# Altium project STLinkV2_1.PrjPcb (part 2 of 3)
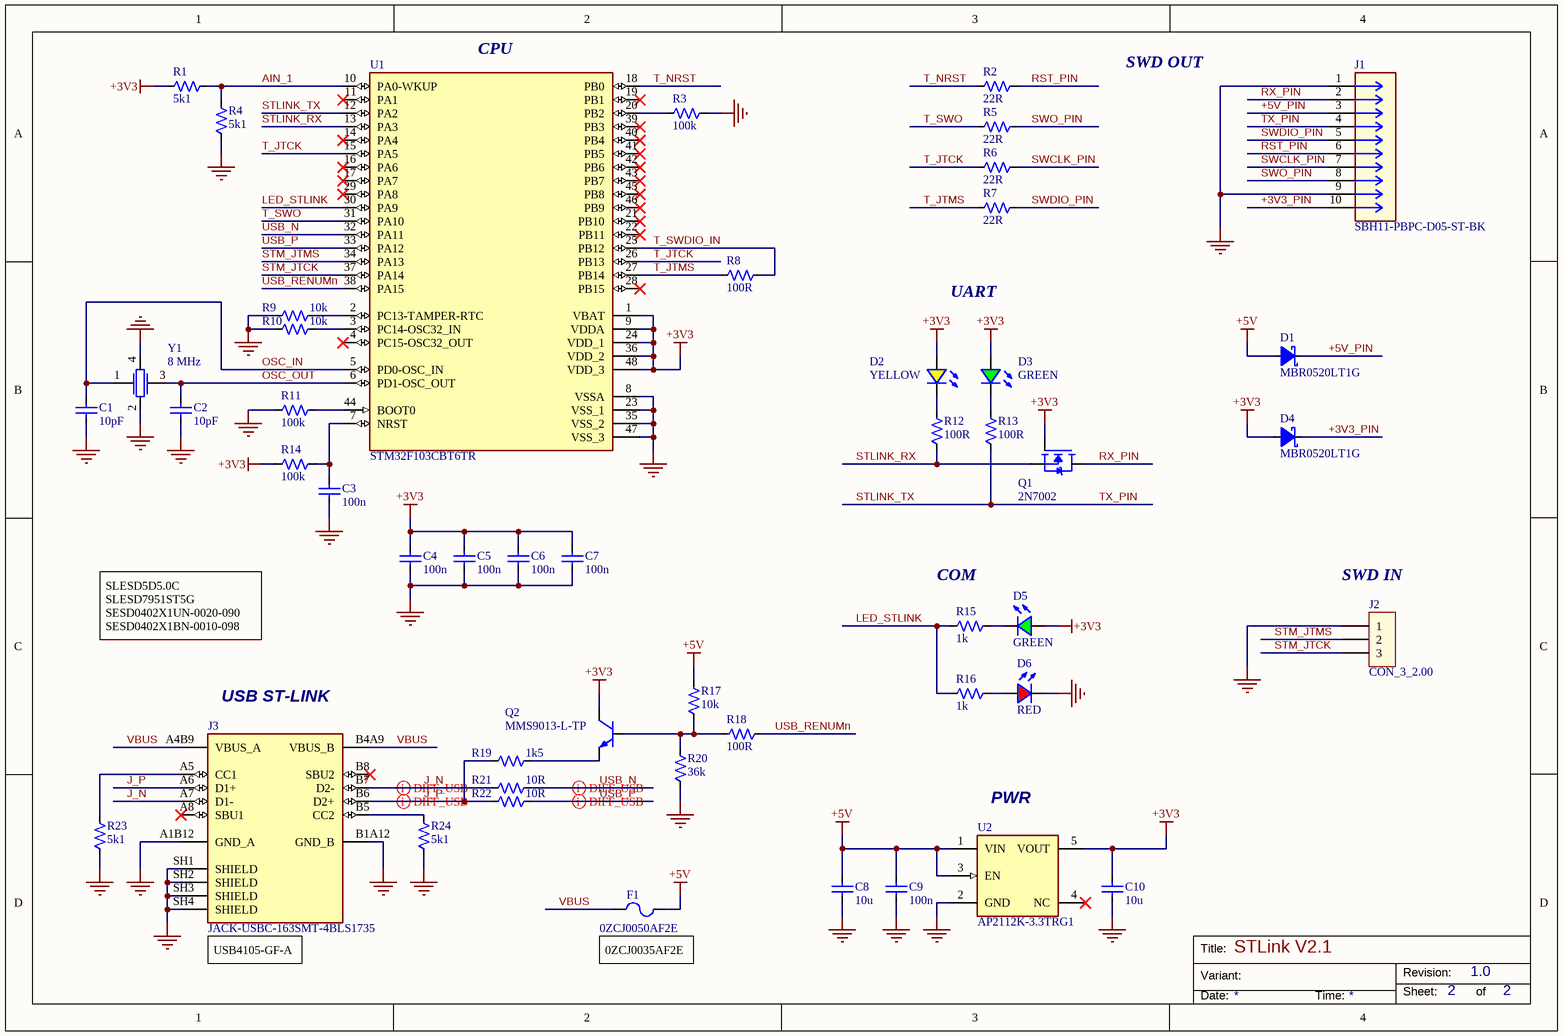
[diagram p2: [02]-STLinkV2_1.SchDoc]

## Sheet [02]-STLinkV2_1.SchDoc (continued)
### Library data of the parts
C1 C2 = CAP_GCM1555C1H100JA16D: 50V 10pF C0G ±5% 0402 Multilayer Ceramic Capacitors MLCC - SMD/SMT ROHS; Manufacturer 1: Murata; Manufacturer Lifecycle Status: IN PRODUCTION; Temperature Coefficient: 30ppm/°C; Supplier 1: DigiKey; Manufacturer Part Number 1: GCM1555C1H100JA16D; Stock 1: 360236; Pricing 1: 1=0,1, 10=0,027, 50=0,0178, 100=0,0152, 500=0,0107, 1000=0,00935, 2500=0,00792, 5000=0,00706 (USD); RoHS: Compliant; Capacitance: 10pF; Case/Package: 0402; Case Code (Imperial): 0402; Case Code (Metric): 1005; Dielectric: C0G; Dielectric Material: Ceramic; Export Control Classification Number (ECCN) Code: EAR99; Height: 500µm; Harmonized Tariff Schedule (HTS) Code: 8532.24.00.20; Introduction Date: 2013-11-20; Lead Free: Lead Free; Length: 1mm; Lifecycle Status: Production; Material: Ceramic; Max Operating Temperature: 125°C; Min Operating Temperature: -55°C; Mount: Surface Mount; Number of Terminals: 2; Ratings: AEC-Q200; REACH SVHC: Yes; Schedule B: 8532240020, 8532240020|8532240020, 8532240020|8532240020|8532240020, 8532240020|8532240020|8532240020|8532240020; Termination: SMD/SMT; Tolerance: 5%; Voltage Rating: 50V; Voltage Rating (DC): 50V; Weight: 6.010099mg; Width: 500µm; ComponentLink1URL: https://datasheet.octopart.com:443/GCM1555C1H100JA16D-Murata-datasheet-149522303.pdf?src-supplier=Farnell; ComponentLink1Description: https://datasheet.octopart.com:443/GCM1555C1H100JA16D-Murata-datasheet-149522303.pdf?src-supplier=Farnell; ComponentLink2URL: https://datasheet.octopart.com:443/GCM1555C1H100JA16D-Murata-datasheet-46741789.pdf?src-supplier=element14+APAC; ComponentLink2Description: https://datasheet.octopart.com:443/GCM1555C1H100JA16D-Murata-datasheet-46741789.pdf?src-supplier=element14+APAC; ComponentLink3URL: https://datasheet.octopart.com:443/GCM1555C1H100JA16D-Murata-datasheet-140655912.pdf?src-supplier=Ciiva; ComponentLink3Description: https://datasheet.octopart.com:443/GCM1555C1H100JA16D-Murata-datasheet-140655912.pdf?src-supplier=Ciiva; ComponentLink4URL: https://datasheet.octopart.com:443/GCM1555C1H100JA16D-Murata-datasheet-138715603.pdf?src-supplier=Ciiva; ComponentLink4Description: https://datasheet.octopart.com:443/GCM1555C1H100JA16D-Murata-datasheet-138715603.pdf?src-supplier=Ciiva; ComponentLink5URL: https://datasheet.octopart.com:443/GCM1555C1H100JA16D-Murata-datasheet-118179445.pdf?src-supplier=Future+Electronics; ComponentLink5Description: https://datasheet.octopart.com:443/GCM1555C1H100JA16D-Murata-datasheet-118179445.pdf?src-supplier=Future+Electronics; ComponentLink6URL: https://datasheet.octopart.com:443/GCM1555C1H100JA16D-Murata-datasheet-12532847.pdf?src-supplier=Future+Electronics; ComponentLink6Description: https://datasheet.octopart.com:443/GCM1555C1H100JA16D-Murata-datasheet-12532847.pdf?src-supplier=Future+Electronics; ComponentLink7URL: https://datasheet.octopart.com:443/GCM1555C1H100JA16D-Murata-datasheet-34148896.pdf?src-supplier=Future+Electronics; ComponentLink7Description: https://datasheet.octopart.com:443/GCM1555C1H100JA16D-Murata-datasheet-34148896.pdf?src-supplier=Future+Electronics; ComponentLink8URL: https://datasheet.octopart.com:443/GCM1555C1H100JA16D-Murata-datasheet-44780974.pdf?src-supplier=Future+Electronics; ComponentLink8Description: https://datasheet.octopart.com:443/GCM1555C1H100JA16D-Murata-datasheet-44780974.pdf?src-supplier=Future+Electronics; ComponentLink9URL: https://datasheet.octopart.com:443/GCM1555C1H100JA16D-Murata-datasheet-12511495.pdf?src-supplier=TME; ComponentLink9Description: https://datasheet.octopart.com:443/GCM1555C1H100JA16D-Murata-datasheet-12511495.pdf?src-supplier=TME; ComponentLink10URL: http://sigma.octopart.com:80/reach_statement/Murata-company-16.pdf?src-supplier=Compliance+Statements; ComponentLink10Description: http://sigma.octopart.com:80/reach_statement/Murata-company-16.pdf?src-supplier=Compliance+Statements; Supplier Part Number 1: 490-10668-1-ND
C3-C7 C9 = CAP_GCM155R71H104KE02D: 50V 100nF X7R ±10% 0402 Multilayer Ceramic Capacitors MLCC - SMD/SMT ROHS; Manufacturer 1: Murata; Manufacturer Lifecycle Status: IN PRODUCTION; Supplier 1: DigiKey; Manufacturer Part Number 1: GCM155R71H104KE02D; Stock 1: 10014269; Pricing 1: 1=0,1, 10=0,032, 50=0,0216, 100=0,0184, 500=0,01308, 1000=0,01147, 2500=0,00978, 5000=0,00876 (USD); RoHS: Compliant; Capacitance: 100nF; Case/Package: 0402; Case Code (Imperial): 0402; Case Code (Metric): 1005; Dielectric: X7R; Dielectric Material: Ceramic; Height: 500µm; Lead Free: Lead Free; Length: 1mm; Lifecycle Status: Production; Material: Ceramic; Max Operating Temperature: 125°C; Min Operating Temperature: -55°C; Mount: Surface Mount; Number of Terminals: 2; Ratings: AEC-Q200; REACH SVHC: Yes; Schedule B: 8532240020, 8532240020|8532240020, 8532240020|8532240020|8532240020, 8532240020|8532240020|8532240020|8532240020; Termination: SMD/SMT; Tolerance: 10%; Voltage Rating: 50V; Voltage Rating (DC): 50V; Weight: 6.010099mg; Width: 500µm; ComponentLink1URL: https://datasheet.octopart.com:443/GCM155R71H104KE02D-Murata-datasheet-149522465.pdf?src-supplier=Farnell; ComponentLink1Description: https://datasheet.octopart.com:443/GCM155R71H104KE02D-Murata-datasheet-149522465.pdf?src-supplier=Farnell; ComponentLink2URL: https://datasheet.octopart.com:443/GCM155R71H104KE02D-Murata-datasheet-66077033.pdf?src-supplier=element14+APAC; ComponentLink2Description: https://datasheet.octopart.com:443/GCM155R71H104KE02D-Murata-datasheet-66077033.pdf?src-supplier=element14+APAC; ComponentLink3URL: https://datasheet.octopart.com:443/GCM155R71H104KE02D-Murata-datasheet-165579661.pdf?src-supplier=TME; ComponentLink3Description: https://datasheet.octopart.com:443/GCM155R71H104KE02D-Murata-datasheet-165579661.pdf?src-supplier=TME; ComponentLink4URL: https://datasheet.octopart.com:443/GCM155R71H104KE02D-Murata-datasheet-141266224.pdf?src-supplier=Ciiva; ComponentLink4Description: https://datasheet.octopart.com:443/GCM155R71H104KE02D-Murata-datasheet-141266224.pdf?src-supplier=Ciiva; ComponentLink5URL: https://datasheet.octopart.com:443/GCM155R71H104KE02D-Murata-datasheet-140656751.pdf?src-supplier=Ciiva; ComponentLink5Description: https://datasheet.octopart.com:443/GCM155R71H104KE02D-Murata-datasheet-140656751.pdf?src-supplier=Ciiva; ComponentLink6URL: https://datasheet.octopart.com:443/GCM155R71H104KE02D-Murata-datasheet-138716456.pdf?src-supplier=Ciiva; ComponentLink6Description: https://datasheet.octopart.com:443/GCM155R71H104KE02D-Murata-datasheet-138716456.pdf?src-supplier=Ciiva; ComponentLink7URL: https://datasheet.octopart.com:443/GCM155R71H104KE02D-Murata-datasheet-12524712.pdf?src-supplier=Future+Electronics; ComponentLink7Description: https://datasheet.octopart.com:443/GCM155R71H104KE02D-Murata-datasheet-12524712.pdf?src-supplier=Future+Electronics; ComponentLink8URL: http://sigma.octopart.com:80/reach_statement/Murata-company-16.pdf?src-supplier=Compliance+Statements; ComponentLink8Description: http://sigma.octopart.com:80/reach_statement/Murata-company-16.pdf?src-supplier=Compliance+Statements; Supplier Part Number 1: 490-10672-1-ND
C8 C10 = GRM188C81C106MA73D: CAP CER 10UF 6.3V X7R 0603; PART DESCRIPTION: 10 µF ±20% 16V Ceramic Capacitor X6S 0603 (1608 Metric); Tolerance: 20%; MFG: Murata Electronics; TEMP COEFFICIENT: X6S; Voltage: 16V; MFG PART NUMBER: GRM188C81C106MA73D; BOM NOTE: -; PACKAGE: 0603; PART TYPE: Capacitor; PART SUPPLIER LINK 1: https://www.digikey.com/en/products/detail/murata-electronics/GRM188C81C106MA73D/3900463
D1 D4 = MBR0520LT1G: Diode, Schottky Barrier, Vr 20V, If 0.5A, Pkg SOD-123, Vf 0.385V, Tj +125DEGC, Cs 5.5A; Manufacturer 1: onsemi; Manufacturer Lifecycle Status: ACTIVE; Average Rectified Current: 500mA; Element Configuration: Single; Forward Voltage: 385mV; Max Junction Temperature (Tj): 125°C; Max Reverse Leakage Current: 250µA; Number of Elements: 1; Polarity: Standard; Supplier 1: DigiKey; Manufacturer Part Number 1: MBR0520LT1G; Stock 1: 764992; Pricing 1: 1=0,23, 10=0,143, 100=0,1257, 500=0,093, 1000=0,08242 (USD); RoHS: Compliant; Breakdown Voltage: 20V; Case/Package: SOD-123-2; China RoHS: Compliant; Contact Plating: Tin; Current Rating: 500mA; Forward Current: 500mA; Height: 1.35mm; Lead Free: Lead Free; Length: 2.69mm; Lifecycle Status: Production; Max Forward Surge Current (Ifsm): 5.5A; Max Operating Temperature: 125°C; Max Output Current: 500mA; Max Repetitive Reverse Voltage (Vrrm): 20V; Max Reverse Voltage (DC): 20V; Max Surge Current: 5.5A; Min Operating Temperature: -65°C; Number of Pins: 2; Number of Terminals: 2; Output Current: 500mA; Packaging: Tape and Reel; Peak Non-Repetitive Surge Current: 5.5A; Peak Reverse Current: 250µA; Radiation Hardening: No; REACH SVHC: Yes; Reverse Standoff Voltage: 20V; Reverse Voltage: 20V; Schedule B: 8541100070, 8541100070|8541100070|8541100070|8541100070|8541100070; Termination: SMD/SMT; Voltage Rating (DC): 20V; Width: 1.6mm; ComponentLink1URL: https://datasheet.octopart.com:443/MBR0520LT1G-ON-Semiconductor-datasheet-11779391.pdf?src-supplier=Newark; ComponentLink1Description: https://datasheet.octopart.com:443/MBR0520LT1G-ON-Semiconductor-datasheet-11779391.pdf?src-supplier=Newark; ComponentLink2URL: https://datasheet.octopart.com:443/MBR0520LT1G-onsemi-datasheet-181959022.pdf?src-supplier=Newark; ComponentLink2Description: https://datasheet.octopart.com:443/MBR0520LT1G-onsemi-datasheet-181959022.pdf?src-supplier=Newark; ComponentLink3URL: https://datasheet.octopart.com:443/MBR0520LT1G-onsemi-datasheet-180961579.pdf?src-supplier=IHS; ComponentLink3Description: https://datasheet.octopart.com:443/MBR0520LT1G-onsemi-datasheet-180961579.pdf?src-supplier=IHS; ComponentLink4URL: https://datasheet.octopart.com:443/MBR0520LT1G-ON-Semiconductor-datasheet-7553569.pdf?src-supplier=Upverter; ComponentLink4Description: https://datasheet.octopart.com:443/MBR0520LT1G-ON-Semiconductor-datasheet-7553569.pdf?src-supplier=Upverter; ComponentLink5URL: https://sigma.octopart.com:443/138897866/technical_drawing/ON-Semiconductor-MBR0520LT1G.pdf?src-supplier=Upverter; ComponentLink5Description: https://sigma.octopart.com:443/138897866/technical_drawing/ON-Semiconductor-MBR0520LT1G.pdf?src-supplier=Upverter; ComponentLink6URL: https://datasheet.octopart.com:443/MBR0520LT1G-onsemi-datasheet-178031877.pdf?src-supplier=Burklin+Elektronik; ComponentLink6Description: https://datasheet.octopart.com:443/MBR0520LT1G-onsemi-datasheet-178031877.pdf?src-supplier=Burklin+Elektronik; ComponentLink7URL: https://datasheet.octopart.com:443/MBR0520LT1G-ON-Semiconductor-datasheet-127372316.pdf?src-supplier=TME; ComponentLink7Description: https://datasheet.octopart.com:443/MBR0520LT1G-ON-Semiconductor-datasheet-127372316.pdf?src-supplier=TME; ComponentLink8URL: https://datasheet.octopart.com:443/MBR0520LT1G-ON-Semiconductor-datasheet-41281291.pdf?src-supplier=Seeed+Studio; ComponentLink8Description: https://datasheet.octopart.com:443/MBR0520LT1G-ON-Semiconductor-datasheet-41281291.pdf?src-supplier=Seeed+Studio; ComponentLink9URL: https://datasheet.octopart.com:443/MBR0520LT1G-ON-Semiconductor-datasheet-9925139.pdf?src-supplier=RS+(Formerly+Allied+Electronics); ComponentLink9Description: https://datasheet.octopart.com:443/MBR0520LT1G-ON-Semiconductor-datasheet-9925139.pdf?src-supplier=RS+(Formerly+Allied+Electronics); ComponentLink10URL: http://sigma.octopart.com:80/150613958/rohs_statement/ON-Semiconductor-MBR0520LT1G.pdf?src-supplier=Compliance+Statements; ComponentLink10Description: http://sigma.octopart.com:80/150613958/rohs_statement/ON-Semiconductor-MBR0520LT1G.pdf?src-supplier=Compliance+Statements; ComponentLink11URL: http://sigma.octopart.com:80/reach_statement/ON-Semiconductor-company-79.pdf?src-supplier=Compliance+Statements; ComponentLink11Description: http://sigma.octopart.com:80/reach_statement/ON-Semiconductor-company-79.pdf?src-supplier=Compliance+Statements; ComponentLink12URL: http://sigma.octopart.com:80/rohs_statement/Fairchild-Semiconductor-company-11.pdf?src-supplier=Compliance+Statements; ComponentLink12Description: http://sigma.octopart.com:80/rohs_statement/Fairchild-Semiconductor-company-11.pdf?src-supplier=Compliance+Statements; ComponentLink13URL: http://sigma.octopart.com:80/rohs_statement/Fairchild-Semiconductor-company-10.pdf?src-supplier=Compliance+Statements; ComponentLink13Description: http://sigma.octopart.com:80/rohs_statement/Fairchild-Semiconductor-company-10.pdf?src-supplier=Compliance+Statements; ComponentLink14URL: http://sigma.octopart.com:80/reach_statement/Fairchild-Semiconductor-company-9.pdf?src-supplier=Compliance+Statements; ComponentLink14Description: http://sigma.octopart.com:80/reach_statement/Fairchild-Semiconductor-company-9.pdf?src-supplier=Compliance+Statements; ComponentLink15URL: https://octopart.com:443/opatz8j6/c1?t=_YjQqLKsC65BFvK1_6UEnwkfXAH7KQR0AUtjQhBbgRcCg4G01S1s7qEN-APRdTq2QxXn1UUlKQRo_8YaIh_9VKpIfqHX6gOCONHURfwzH6xXAs9QBLkjiHNMlU-lF7qP-hjNkNERQ_k0kIA2p9qebgDdvTYghquJ2ZyH6YsgiUFZY5VMTUw-sdciFu9LUViUlipbx-n_nEcjMQdjF64MNq6xlfh4VgxvMgvBpPYsY9qgcJnzVRziJeVk76fVr6xE-wMFazzuDiOLkTxZV3gsIM-ts8FvcqA94y80ziAYgBJFbAZoRbZHPUojn3xAN_DZBogCra4-6Hj4KsUUClm2Wd8ViyY7UTH0NpE-&src-supplier=Compliance+Statements; ComponentLink15Description: https://octopart.com:443/opatz8j6/c1?t=_YjQqLKsC65BFvK1_6UEnwkfXAH7KQR0AUtjQhBbgRcCg4G01S1s7qEN-APRdTq2QxXn1UUlKQRo_8YaIh_9VKpIfqHX6gOCONHURfwzH6xXAs9QBLkjiHNMlU-lF7qP-hjNkNERQ_k0kIA2p9qebgDdvTYghquJ2ZyH6YsgiUFZY5VMTUw-sdciFu9LUViUlipbx-n_nEcjMQdjF64MNq6xlfh4VgxvMgvBpPYsY9qgcJnzVRziJeVk76fVr6xE-wMFazzuDiOLkTxZV3gsIM-ts8FvcqA94y80ziAYgBJFbAZoRbZHPUojn3xAN_DZBogCra4-6Hj4KsUUClm2Wd8ViyY7UTH0NpE-&src-supplier=Compliance+Statements; ComponentLink16URL: https://octopart.com:443/opatz8j6/c1?t=465MS6kK7cso_W2dWapH1mwugolUieMrJ6T8zH1kmzm4_X9ivAN38YPFckio7psQS8nb0y8GaMgcsjpTEVjVFlqaa1naUWp6vBVHW5EhU-_VxxIgVrU4nMQA3_0Mqzco5Yod9y9U29cn2w3eNtdtML414xSFEkkQp3vLZgwv5e3p3sPIG7iVZSC5cxI-QwztRS1CwUW0gZ0Pzn3BpFoj-jzdQ6bC_nr0LdqYIQTJjjCGhTSYPxbUt5ip7EEgJhUucOCa39zSMmEBeIdXKchgLH2Rj25NMoKiuINMY1uhwn7UPETgW0-6uucpjhPoe9C5c1Xf4rs0iSwfvb7ymc0hqIZPVft-ekS-NDo&src-supplier=Compliance+Statements; ComponentLink16Description: https://octopart.com:443/opatz8j6/c1?t=465MS6kK7cso_W2dWapH1mwugolUieMrJ6T8zH1kmzm4_X9ivAN38YPFckio7psQS8nb0y8GaMgcsjpTEVjVFlqaa1naUWp6vBVHW5EhU-_VxxIgVrU4nMQA3_0Mqzco5Yod9y9U29cn2w3eNtdtML414xSFEkkQp3vLZgwv5e3p3sPIG7iVZSC5cxI-QwztRS1CwUW0gZ0Pzn3BpFoj-jzdQ6bC_nr0LdqYIQTJjjCGhTSYPxbUt5ip7EEgJhUucOCa39zSMmEBeIdXKchgLH2Rj25NMoKiuINMY1uhwn7UPETgW0-6uucpjhPoe9C5c1Xf4rs0iSwfvb7ymc0hqIZPVft-ekS-NDo&src-supplier=Compliance+Statements; Supplier Part Number 1: MBR0520LT1GOSDKR-ND
D2 = 150060YS75003: Led, Yellow, 550Mcd, 595Nm Rohs Compliant: Yes; Manufacturer 1: Wurth Elektronik; Dominant Wavelength: 585nm; Forward Current: 100mA; Forward Voltage: 2V; Max Reverse Voltage (DC): 5V; Viewing Angle: 140°; Supplier 1: DigiKey; Manufacturer Part Number 1: 150060YS75003; Stock 1: 10261; Pricing 1: 1=0,35, 50=0,283, 100=0,249, 250=0,226, 1000=0,19278 (USD); RoHS: Compliant; Luminous Intensity: 550mcd; Max Operating Temperature: 100°C; Min Operating Temperature: -40°C; Peak Wavelength: 595nm; ComponentLink1URL: https://datasheet.octopart.com:443/150060YS75003-Wurth-Elektronik-datasheet-168473778.pdf?src-supplier=Farnell; ComponentLink1Description: https://datasheet.octopart.com:443/150060YS75003-Wurth-Elektronik-datasheet-168473778.pdf?src-supplier=Farnell; Supplier Part Number 1: 732-150060YS75003CT-ND
D3 D5 = 150060VS75003: Led, Bright Green, 100Mcd, 572Nm Rohs Compliant: Yes; Manufacturer 1: Wurth Elektronik; Dominant Wavelength: 567nm; Forward Current: 100mA; Forward Voltage: 2V; Max Reverse Voltage (DC): 5V; Viewing Angle: 140°; Supplier 1: DigiKey; Manufacturer Part Number 1: 150060VS75003; Stock 1: 1618; Pricing 1: 1=0,35, 50=0,283, 100=0,249, 250=0,226, 1000=0,19278 (USD); RoHS: Compliant; Height: 700µm; Length: 1.6mm; Luminous Intensity: 100mcd; Max Operating Temperature: 100°C; Min Operating Temperature: -40°C; Peak Wavelength: 572nm; Width: 800µm; ComponentLink1URL: https://datasheet.octopart.com:443/150060VS75003-Wurth-Elektronik-datasheet-168473758.pdf?src-supplier=Farnell; ComponentLink1Description: https://datasheet.octopart.com:443/150060VS75003-Wurth-Elektronik-datasheet-168473758.pdf?src-supplier=Farnell; Supplier Part Number 1: 732-150060VS75003CT-ND
D6 = 150060RS75003: SMT Mono-Color Chip LED Waterclear Advance WL-SMCW_0603_ADVANCE; Manufacturer 1: Wurth Elektronik; Dominant Wavelength: 615nm; Forward Current: 100mA; Forward Voltage: 2V; Luminous Intensity: 530mcd; Max Junction Temperature (Tj): 125°C; Max Reverse Voltage (DC): 5V; Peak Wavelength: 630nm; Power Dissipation: 78mW; Viewing Angle: 140°; Wavelength: 625nm; Supplier 1: DigiKey; Manufacturer Part Number 1: 150060RS75003; Stock 1: 49005; Pricing 1: 1=0,35, 50=0,283, 100=0,249, 250=0,226, 1000=0,19278 (USD); RoHS: Compliant; Case/Package: 0603; Color: Red; Height: 800µm; Max Operating Temperature: 100°C; Min Operating Temperature: -40°C; Reverse Voltage: 5V; ComponentLink1URL: https://datasheet.octopart.com:443/150060RS75003-Wurth-Elektronik-datasheet-170333962.pdf?src-supplier=Farnell; ComponentLink1Description: https://datasheet.octopart.com:443/150060RS75003-Wurth-Elektronik-datasheet-170333962.pdf?src-supplier=Farnell; Supplier Part Number 1: 732-150060RS75003CT-ND
F1 = 0ZCJ0050AF2E: Resettable Fuse, PPTC, 1206 (3216 Metric), 0ZCJ Series, 24 VDC, 500 mA, 1 A, 0.1 s; Manufacturer 1: Bel Fuse; Approvals: TUV, UL; Current Rating: 100A; Hold Current: 500mA; Maximum Resistance 1 Hour (R1max): 750mΩ; Max Voltage Rating (DC): 24V; Power Dissipation: 600mW; Resistance: 150mΩ; Time to Trip: 100ms; Trip Current: 1A; Supplier 1: DigiKey; Manufacturer Part Number 1: 0ZCJ0050AF2E; Stock 1: 130033; Pricing 1: 1=0,28, 5=0,234, 10=0,215, 50=0,1786, 100=0,1649, 250=0,14824, 500=0,13676, 1000=0,12615 (USD); RoHS: Compliant; Case/Package: 1206; Case Code (Imperial): 1206; Case Code (Metric): 3216; China RoHS: Compliant; Contact Plating: Tin; Height: 1.2mm; Lead Free: Lead Free; Lifecycle Status: Production; Max Current Rating: 100A; Max Operating Temperature: 85°C; Min Operating Temperature: -40°C; Mount: Surface Mount; Number of Terminals: 2; Packaging: Tape & Reel (TR); REACH SVHC: Yes; Schedule B: 8533290000|8533290000|8533290000|8533290000|8533290000|8533290000|8533290000|8533290000|8533290000|8533290000|8533290000|8533290000|8533290000|8533290000|8533290000|8533290000|8533290000|8533290000|8533290000|8533290000|8533290000|8533290000|8533290000|85; Voltage Rating: 24V; Width: 1.8mm; Working Voltage: 24V; ComponentLink1URL: https://datasheet.octopart.com:443/0ZCJ0050AF2E-Bel-Fuse-datasheet-182141362.pdf?src-supplier=IHS; ComponentLink1Description: https://datasheet.octopart.com:443/0ZCJ0050AF2E-Bel-Fuse-datasheet-182141362.pdf?src-supplier=IHS; ComponentLink2URL: https://datasheet.octopart.com:443/0ZCJ0050AF2E-Bel-Fuse-datasheet-137696978.pdf?src-supplier=Electro+Sonic; ComponentLink2Description: https://datasheet.octopart.com:443/0ZCJ0050AF2E-Bel-Fuse-datasheet-137696978.pdf?src-supplier=Electro+Sonic; ComponentLink3URL: https://datasheet.octopart.com:443/0ZCJ0050AF2E-Bel-Fuse-datasheet-179230428.pdf?src-supplier=Electro+Sonic; ComponentLink3Description: https://datasheet.octopart.com:443/0ZCJ0050AF2E-Bel-Fuse-datasheet-179230428.pdf?src-supplier=Electro+Sonic; ComponentLink4URL: https://datasheet.octopart.com:443/0ZCJ0050AF2E-Bel-Fuse-datasheet-102831406.pdf?src-supplier=Sager+Electronics; ComponentLink4Description: https://datasheet.octopart.com:443/0ZCJ0050AF2E-Bel-Fuse-datasheet-102831406.pdf?src-supplier=Sager+Electronics; ComponentLink5URL: https://datasheet.octopart.com/0ZCJ0050AF2E-Bel-Fuse-datasheet-66464704.pdf; ComponentLink5Description: https://datasheet.octopart.com/0ZCJ0050AF2E-Bel-Fuse-datasheet-66464704.pdf; Supplier Part Number 1: 5923-0ZCJ0050AF2ECT-ND
J1 = SBH11-PBPC-D05-ST-BK: Conn Shrouded Header (4 Sides) HDR 10 POS 2.54mm Solder ST Top Entry Thru-Hole; Manufacturer 1: Sullins; Connector Type: Male Pin; Contact Resistance: 20mΩ; Current Rating: 3A; Insulation Resistance: 5GΩ; Number of Positions: 10; Supplier 1: DigiKey; Manufacturer Part Number 1: SBH11-PBPC-D05-ST-BK; Stock 1: 128871; Pricing 1: 1=0,24, 10=0,204, 100=0,1737, 500=0,15504, 1000=0,14762, 5000=0,13176, 10000=0,12547 (USD); RoHS: Compliant; Color: Black; Contact Gender: Male; Contact Plating: Gold; Lead Free: Lead Free; Lifecycle Status: Production; Max Operating Temperature: 105°C; Min Operating Temperature: -40°C; Mount: Through Hole; Number of Pins: 10; Number of Rows: 2; Pitch: 2.54mm; REACH SVHC: Yes; Row Spacing: 2.54mm; Terminal Pitch: 2.54mm; Termination: Solder; ComponentLink1URL: https://datasheet.octopart.com:443/SBH11-PBPC-D05-ST-BK-Sullins-datasheet-83216131.pdf?src-supplier=IHS; ComponentLink1Description: https://datasheet.octopart.com:443/SBH11-PBPC-D05-ST-BK-Sullins-datasheet-83216131.pdf?src-supplier=IHS; ComponentLink2URL: https://datasheet.octopart.com:443/SBH11-PBPC-D05-ST-BK-Sullins-datasheet-17023157.pdf?src-supplier=Upverter; ComponentLink2Description: https://datasheet.octopart.com:443/SBH11-PBPC-D05-ST-BK-Sullins-datasheet-17023157.pdf?src-supplier=Upverter; ComponentLink3URL: https://datasheet.octopart.com:443/SBH11-PBPC-D05-ST-BK-Sullins-datasheet-145017814.pdf?src-supplier=ODG+(Origin+Data+Global); ComponentLink3Description: https://datasheet.octopart.com:443/SBH11-PBPC-D05-ST-BK-Sullins-datasheet-145017814.pdf?src-supplier=ODG+(Origin+Data+Global); ComponentLink4URL: https://datasheet.octopart.com:443/SBH11-PBPC-D05-ST-BK-Sullins-datasheet-41399312.pdf?src-supplier=Future+Electronics; ComponentLink4Description: https://datasheet.octopart.com:443/SBH11-PBPC-D05-ST-BK-Sullins-datasheet-41399312.pdf?src-supplier=Future+Electronics; ComponentLink5URL: https://datasheet.octopart.com:443/SBH11-PBPC-D05-ST-BK-Sullins-datasheet-12512855.pdf?src-supplier=Future+Electronics; ComponentLink5Description: https://datasheet.octopart.com:443/SBH11-PBPC-D05-ST-BK-Sullins-datasheet-12512855.pdf?src-supplier=Future+Electronics; Supplier Part Number 1: S9169-ND
J3 = JACK-USBC-163SMT-4BLS1735: Usb Type C Jack IPX7 SMT; Manufacturer 1: GlobTek; Supplier 1: DigiKey; Manufacturer Part Number 1: JACK-USBC-163SMT-4BLS1735; Stock 1: 4264; Pricing 1: 1=0,76, 10=0,646, 25=0,6056, 50=0,5766, 100=0,5489, 250=0,51452, 500=0,48992, 1000=0,46653, 3000=0,43173 (USD); Supplier Part Number 1: 1939-JACK-USBC-163SMT-4BLS1735-ND
Q1 = 2N7002H6327XTSA2: MOSFET N-CH 60V 300MA SOT23-3 N-Channel 60 V 300mA (Ta) 500mW (Ta) Surface Mount PG-SOT23; Manufacturer 1: Infineon; Drain to Source Resistance: 3Ω; Element Configuration: Single; Gate to Source Voltage (Vgs): 20V; Input Capacitance: 13pF; Max Junction Temperature (Tj): 150°C; Number of Channels: 1; Rise Time: 3.3ns; Threshold Voltage: 2.1V; Turn-Off Delay Time: 5.5ns; Turn-On Delay Time: 3ns; Supplier 1: DigiKey; Manufacturer Part Number 1: 2N7002H6327XTSA2; Stock 1: 56295; Pricing 1: 1=0,22, 10=0,136, 100=0,084, 500=0,06146, 1000=0,05414 (USD); RoHS: Compliant; Case/Package: SOT-23; China RoHS: Compliant; Contact Plating: Tin; Continuous Drain Current (ID): 300mA; Drain to Source Breakdown Voltage: 60V; Drain to Source Voltage (Vdss): 60V; Halogen Free: Halogen Free; Height: 1.1mm; Lead Free: Lead Free; Length: 2.9mm; Lifecycle Status: Production; Max Dual Supply Voltage: 60V; Max Operating Temperature: 150°C; Max Power Dissipation: 500mW; Min Breakdown Voltage: 60V; Min Operating Temperature: -55°C; Mount: Surface Mount; Number of Elements: 1; Number of Pins: 3; Number of Terminals: 3; On-State Resistance: 3Ω; Package Quantity: 3000; Packaging: Tape & Reel; Power Dissipation: 500mW; Rds On Max: 3Ω; REACH SVHC: Yes; Schedule B: 8541210080, 8541210080|8541210080, 8541210080|8541210080|8541210080, 8541210080|8541210080|8541210080|8541210080; Width: 1.3mm; ComponentLink1URL: https://datasheet.octopart.com:443/2N7002H6327XTSA2-Infineon-datasheet-13726707.pdf?src-supplier=ODG+(Origin+Data+Global); ComponentLink1Description: https://datasheet.octopart.com:443/2N7002H6327XTSA2-Infineon-datasheet-13726707.pdf?src-supplier=ODG+(Origin+Data+Global); ComponentLink2URL: https://datasheet.octopart.com:443/2N7002H6327XTSA2-Infineon-datasheet-180049070.pdf?src-supplier=IHS; ComponentLink2Description: https://datasheet.octopart.com:443/2N7002H6327XTSA2-Infineon-datasheet-180049070.pdf?src-supplier=IHS; ComponentLink3URL: https://datasheet.octopart.com:443/2N7002-Infineon-datasheet-180049069.pdf?src-supplier=IHS; ComponentLink3Description: https://datasheet.octopart.com:443/2N7002-Infineon-datasheet-180049069.pdf?src-supplier=IHS; ComponentLink4URL: https://datasheet.octopart.com:443/2N7002H6327XTSA2-Infineon-datasheet-10741796.pdf?src-supplier=Farnell; ComponentLink4Description: https://datasheet.octopart.com:443/2N7002H6327XTSA2-Infineon-datasheet-10741796.pdf?src-supplier=Farnell; ComponentLink5URL: https://datasheet.octopart.com:443/2N7002-H6327-Infineon-datasheet-42562917.pdf?src-supplier=Farnell; ComponentLink5Description: https://datasheet.octopart.com:443/2N7002-H6327-Infineon-datasheet-42562917.pdf?src-supplier=Farnell; ComponentLink6URL: https://datasheet.octopart.com:443/2N7002H6327XTSA2-Infineon-datasheet-82555324.pdf?src-supplier=Farnell; ComponentLink6Description: https://datasheet.octopart.com:443/2N7002H6327XTSA2-Infineon-datasheet-82555324.pdf?src-supplier=Farnell; ComponentLink7URL: https://datasheet.octopart.com:443/2N7002H6327XTSA2-Infineon-datasheet-78731672.pdf?src-supplier=Farnell; ComponentLink7Description: https://datasheet.octopart.com:443/2N7002H6327XTSA2-Infineon-datasheet-78731672.pdf?src-supplier=Farnell; ComponentLink8URL: https://datasheet.octopart.com:443/2N7002-Infineon-datasheet-10733446.pdf?src-supplier=iiiC; ComponentLink8Description: https://datasheet.octopart.com:443/2N7002-Infineon-datasheet-10733446.pdf?src-supplier=iiiC; ComponentLink9URL: http://sigma.octopart.com:80/conflict_mineral_statement/Infineon-company-51.pdf?src-supplier=Compliance+Statements; ComponentLink9Description: http://sigma.octopart.com:80/conflict_mineral_statement/Infineon-company-51.pdf?src-supplier=Compliance+Statements; Supplier Part Number 1: 2N7002H6327XTSA2CT-ND
Q2 = MMS9013-L-TP: Small Signal Bipolar Transistor, 0.5A I(C), 25V V(BR)CEO, 1-Element, NPN, Silicon; Manufacturer 1: MCC; Collector Base Voltage (VCBO): 40V; Emitter Base Voltage (VEBO): 5V; Frequency: 150MHz; hFE Min: 120; Max Collector Current: 500mA; Max Power Dissipation: 300mW; Number of Elements: 1; Supplier 1: DigiKey; Manufacturer Part Number 1: MMS9013-L-TP; Stock 1: 2828; Pricing 1: 1=0,23, 10=0,139, 100=0,0859, 500=0,06288, 1000=0,05541, 2000=0,0491, 5000=0,04225, 10000=0,038, 50000=0,03056 (USD); RoHS: Compliant; Case/Package: SOT-23; China RoHS: Compliant; Collector Emitter Voltage (VCEO): 25V; Lifecycle Status: Production; Max Operating Temperature: 150°C; Min Operating Temperature: -55°C; Mount: Surface Mount; Number of Pins: 3; Number of Terminals: 3; Packaging: Tape and Reel; Polarity: NPN; Power Dissipation: 300mW; REACH SVHC: Yes; Transition Frequency: 150MHz; ComponentLink1URL: https://datasheet.octopart.com:443/MMS9013-L-TP-MCC-datasheet-179878720.pdf?src-supplier=IHS; ComponentLink1Description: https://datasheet.octopart.com:443/MMS9013-L-TP-MCC-datasheet-179878720.pdf?src-supplier=IHS; ComponentLink2URL: https://datasheet.octopart.com:443/MMS9013-L-TP-MCC-datasheet-101746169.pdf?src-supplier=IHS; ComponentLink2Description: https://datasheet.octopart.com:443/MMS9013-L-TP-MCC-datasheet-101746169.pdf?src-supplier=IHS; Supplier Part Number 1: 353-MMS9013-L-TP-ND
R1 R4 R23 R24 = RES_AC0402FR-135K1L: Res Thick Film 0402 5.1K Ohm 1% 0.063W(1/16W) ±100ppm/°C Pad SMD T/R Automotive AEC-Q200; Manufacturer 1: Yageo Group; Power Dissipation: 62.5mW; Resistance: 5.1kΩ; Voltage Rating: 50V; Supplier 1: DigiKey; Manufacturer Part Number 1: AC0402FR-135K1L; Stock 1: 118666; Pricing 1: 1=0,1, 10=0,023, 25=0,0164, 50=0,0132, 100=0,0107, 250=0,00824, 500=0,00686, 1000=0,00577, 5000=0,00407 (USD); RoHS: Compliant; Case/Package: 0402; China RoHS: Non-Compliant; Composition: Thick Film; Country of Origin: Mainland China, Taiwan; Export Control Classification Number (ECCN) Code: EAR99; Height: 320µm; Harmonized Tariff Schedule (HTS) Code: 8533.21.00.30; Introduction Date: 2012-04-10; Lifecycle Status: Production; Max Operating Temperature: 155°C; Min Operating Temperature: -55°C; Mount: Surface Mount; Number of Terminals: 2; Packaging: Tape & Reel; Power Rating: 62.5mW; REACH SVHC: Yes; Temperature Coefficient: 100ppm/°C; Tolerance: 1%; Width: 500µm; Working Voltage: 50V; ComponentLink1URL: https://datasheet.octopart.com:443/AC0402FR-135K1L-Yageo-datasheet-182189377.pdf?src-supplier=IHS; ComponentLink1Description: https://datasheet.octopart.com:443/AC0402FR-135K1L-Yageo-datasheet-182189377.pdf?src-supplier=IHS; ComponentLink2URL: https://datasheet.octopart.com:443/AC0402FR-135K1L-Yageo-datasheet-83209224.pdf?src-supplier=Upverter; ComponentLink2Description: https://datasheet.octopart.com:443/AC0402FR-135K1L-Yageo-datasheet-83209224.pdf?src-supplier=Upverter; ComponentLink3URL: https://datasheet.octopart.com:443/AC0402FR-135K1L-Yageo-Group-datasheet-189830439.pdf?src-supplier=Future+Electronics; ComponentLink3Description: https://datasheet.octopart.com:443/AC0402FR-135K1L-Yageo-Group-datasheet-189830439.pdf?src-supplier=Future+Electronics; ComponentLink4URL: https://datasheet.octopart.com:443/AC0402FR-135K1L-Yageo-datasheet-166720450.pdf?src-supplier=Future+Electronics; ComponentLink4Description: https://datasheet.octopart.com:443/AC0402FR-135K1L-Yageo-datasheet-166720450.pdf?src-supplier=Future+Electronics; ComponentLink5URL: https://datasheet.octopart.com:443/AC0402FR-135K1L-Yageo-datasheet-164768995.pdf?src-supplier=Future+Electronics; ComponentLink5Description: https://datasheet.octopart.com:443/AC0402FR-135K1L-Yageo-datasheet-164768995.pdf?src-supplier=Future+Electronics; ComponentLink6URL: https://datasheet.octopart.com/AC0402FR-135K1L-Yageo-datasheet-12512238.pdf; ComponentLink6Description: https://datasheet.octopart.com/AC0402FR-135K1L-Yageo-datasheet-12512238.pdf; ComponentLink7URL: http://sigma.octopart.com:80/conflict_mineral_statement/Yageo-company-3.pdf?src-supplier=Compliance+Statements; ComponentLink7Description: http://sigma.octopart.com:80/conflict_mineral_statement/Yageo-company-3.pdf?src-supplier=Compliance+Statements; ComponentLink8URL: http://sigma.octopart.com:80/rohs_statement/Yageo-company-2.pdf?src-supplier=Compliance+Statements; ComponentLink8Description: http://sigma.octopart.com:80/rohs_statement/Yageo-company-2.pdf?src-supplier=Compliance+Statements; Supplier Part Number 1: 13-AC0402FR-135K1LCT-ND
R2 R5-R7 = RES_AC0402FR-7W22RL: 125mW Thick Film Resistors ±100ppm/℃ ±1% 22Ω 0402 Chip Resistor - Surface Mount ROHS; Manufacturer 1: Yageo Group; Temperature Coefficient: 100ppm/°C; Voltage Rating: 50V; Working Voltage: 75V; Supplier 1: DigiKey; Manufacturer Part Number 1: AC0402FR-7W22RL; Stock 1: 18426; Pricing 1: 1=0,1, 10=0,006, 25=0,0056, 50=0,0052, 100=0,005 (USD); RoHS: Compliant; Case/Package: 0402; China RoHS: Non-Compliant; Composition: Thick Film; Country of Origin: Mainland China, Taiwan; Export Control Classification Number (ECCN) Code: EAR99; Height: 320µm; Harmonized Tariff Schedule (HTS) Code: 8533.21.00.30; Introduction Date: 2017-06-20; Lifecycle Status: Production; Max Operating Temperature: 155°C; Min Operating Temperature: -55°C; Mount: Surface Mount; Number of Terminals: 2; Packaging: Tape & Reel; Power Dissipation: 125mW; Power Rating: 125mW; REACH SVHC: Yes; Resistance: 22Ω; Tolerance: 1%; Width: 500µm; ComponentLink1URL: https://datasheet.octopart.com:443/AC0402FR-7W22RL-Yageo-datasheet-182189377.pdf?src-supplier=IHS; ComponentLink1Description: https://datasheet.octopart.com:443/AC0402FR-7W22RL-Yageo-datasheet-182189377.pdf?src-supplier=IHS; ComponentLink2URL: https://datasheet.octopart.com:443/AC0402FR-7W22RL-Yageo-datasheet-83209224.pdf?src-supplier=Upverter; ComponentLink2Description: https://datasheet.octopart.com:443/AC0402FR-7W22RL-Yageo-datasheet-83209224.pdf?src-supplier=Upverter; ComponentLink3URL: https://datasheet.octopart.com:443/AC0402FR-7W22RL-Yageo-datasheet-178509465.pdf?src-supplier=Farnell; ComponentLink3Description: https://datasheet.octopart.com:443/AC0402FR-7W22RL-Yageo-datasheet-178509465.pdf?src-supplier=Farnell; ComponentLink4URL: https://datasheet.octopart.com:443/AC0402FR-7W22RL-Yageo-datasheet-166720450.pdf?src-supplier=Future+Electronics; ComponentLink4Description: https://datasheet.octopart.com:443/AC0402FR-7W22RL-Yageo-datasheet-166720450.pdf?src-supplier=Future+Electronics; ComponentLink5URL: https://datasheet.octopart.com:443/AC0402FR-7W22RL-Yageo-datasheet-151884373.pdf?src-supplier=Future+Electronics; ComponentLink5Description: https://datasheet.octopart.com:443/AC0402FR-7W22RL-Yageo-datasheet-151884373.pdf?src-supplier=Future+Electronics; ComponentLink6URL: https://datasheet.octopart.com:443/AC0402FR-7W22RL-Yageo-Group-datasheet-164768995.pdf?src-supplier=ODG+(Origin+Data+Global); ComponentLink6Description: https://datasheet.octopart.com:443/AC0402FR-7W22RL-Yageo-Group-datasheet-164768995.pdf?src-supplier=ODG+(Origin+Data+Global); ComponentLink7URL: https://datasheet.octopart.com/AC0402FR-7W22RL-Yageo-datasheet-12512238.pdf; ComponentLink7Description: https://datasheet.octopart.com/AC0402FR-7W22RL-Yageo-datasheet-12512238.pdf; ComponentLink8URL: http://sigma.octopart.com:80/conflict_mineral_statement/Yageo-company-3.pdf?src-supplier=Compliance+Statements; ComponentLink8Description: http://sigma.octopart.com:80/conflict_mineral_statement/Yageo-company-3.pdf?src-supplier=Compliance+Statements; ComponentLink9URL: http://sigma.octopart.com:80/rohs_statement/Yageo-company-2.pdf?src-supplier=Compliance+Statements; ComponentLink9Description: http://sigma.octopart.com:80/rohs_statement/Yageo-company-2.pdf?src-supplier=Compliance+Statements; Supplier Part Number 1: 13-AC0402FR-7W22RLCT-ND
R3 R11 R14 = RES_AC0402FR-7W100KL: Res Thick Film 0402 100K Ohm 1% 0.125W(1/8W) ±100ppm/°C Pad SMD T/R Automotive AEC-Q200; Manufacturer 1: Yageo Group; Power Dissipation: 125mW; Resistance: 100kΩ; Voltage Rating: 50V; Working Voltage: 75V; Supplier 1: DigiKey; Manufacturer Part Number 1: AC0402FR-7W100KL; Stock 1: 106788; Pricing 1: 1=0,1, 10=0,006, 25=0,0056, 50=0,0052, 100=0,005 (USD); RoHS: Compliant; Case/Package: 0402; China RoHS: Non-Compliant; Composition: Thick Film; Country of Origin: Mainland China, Taiwan; Export Control Classification Number (ECCN) Code: EAR99; Height: 320µm; Harmonized Tariff Schedule (HTS) Code: 8533.21.00.30; Introduction Date: 2017-06-20; Lifecycle Status: Production; Max Operating Temperature: 155°C; Min Operating Temperature: -55°C; Mount: Surface Mount; Number of Terminals: 2; Packaging: Tape & Reel; Power Rating: 125mW; REACH SVHC: Yes; Temperature Coefficient: 100ppm/°C; Tolerance: 1%; Width: 500µm; ComponentLink1URL: https://datasheet.octopart.com:443/AC0402FR-7W100KL-Yageo-datasheet-182189377.pdf?src-supplier=IHS; ComponentLink1Description: https://datasheet.octopart.com:443/AC0402FR-7W100KL-Yageo-datasheet-182189377.pdf?src-supplier=IHS; ComponentLink2URL: https://datasheet.octopart.com:443/AC0402FR-7W100KL-Yageo-datasheet-83209224.pdf?src-supplier=Upverter; ComponentLink2Description: https://datasheet.octopart.com:443/AC0402FR-7W100KL-Yageo-datasheet-83209224.pdf?src-supplier=Upverter; ComponentLink3URL: https://datasheet.octopart.com:443/AC0402FR-7W100KL-Yageo-datasheet-178509465.pdf?src-supplier=Newark; ComponentLink3Description: https://datasheet.octopart.com:443/AC0402FR-7W100KL-Yageo-datasheet-178509465.pdf?src-supplier=Newark; ComponentLink4URL: https://datasheet.octopart.com:443/AC0402FR-7W100KL-Yageo-Group-datasheet-189830439.pdf?src-supplier=Future+Electronics; ComponentLink4Description: https://datasheet.octopart.com:443/AC0402FR-7W100KL-Yageo-Group-datasheet-189830439.pdf?src-supplier=Future+Electronics; ComponentLink5URL: https://datasheet.octopart.com:443/AC0402FR-7W100KL-Yageo-datasheet-166720450.pdf?src-supplier=Future+Electronics; ComponentLink5Description: https://datasheet.octopart.com:443/AC0402FR-7W100KL-Yageo-datasheet-166720450.pdf?src-supplier=Future+Electronics; ComponentLink6URL: https://datasheet.octopart.com:443/AC0402FR-7W100KL-Yageo-datasheet-151884373.pdf?src-supplier=Future+Electronics; ComponentLink6Description: https://datasheet.octopart.com:443/AC0402FR-7W100KL-Yageo-datasheet-151884373.pdf?src-supplier=Future+Electronics; ComponentLink7URL: https://datasheet.octopart.com:443/AC0402FR-7W100KL-Yageo-datasheet-137699919.pdf?src-supplier=Future+Electronics; ComponentLink7Description: https://datasheet.octopart.com:443/AC0402FR-7W100KL-Yageo-datasheet-137699919.pdf?src-supplier=Future+Electronics; ComponentLink8URL: https://datasheet.octopart.com:443/AC0402FR-7W100KL-Yageo-Group-datasheet-164768995.pdf?src-supplier=ODG+(Origin+Data+Global); ComponentLink8Description: https://datasheet.octopart.com:443/AC0402FR-7W100KL-Yageo-Group-datasheet-164768995.pdf?src-supplier=ODG+(Origin+Data+Global); ComponentLink9URL: https://datasheet.octopart.com:443/AC0402FR-7W100KL-Yageo-Group-datasheet-159083007.pdf?src-supplier=HQonline; ComponentLink9Description: https://datasheet.octopart.com:443/AC0402FR-7W100KL-Yageo-Group-datasheet-159083007.pdf?src-supplier=HQonline; ComponentLink10URL: https://datasheet.octopart.com/AC0402FR-7W100KL-Yageo-datasheet-12512238.pdf; ComponentLink10Description: https://datasheet.octopart.com/AC0402FR-7W100KL-Yageo-datasheet-12512238.pdf; ComponentLink11URL: http://sigma.octopart.com:80/conflict_mineral_statement/Yageo-company-3.pdf?src-supplier=Compliance+Statements; ComponentLink11Description: http://sigma.octopart.com:80/conflict_mineral_statement/Yageo-company-3.pdf?src-supplier=Compliance+Statements; ComponentLink12URL: http://sigma.octopart.com:80/rohs_statement/Yageo-company-2.pdf?src-supplier=Compliance+Statements; ComponentLink12Description: http://sigma.octopart.com:80/rohs_statement/Yageo-company-2.pdf?src-supplier=Compliance+Statements; Supplier Part Number 1: 13-AC0402FR-7W100KLCT-ND
R8 R12 R13 R18 = RES_AC0402FR-7W100RL: Res Thick Film 0402 100 Ohm 1% 0.125W(1/8W) ±100ppm/C Pad SMD T/R Automotive AEC-Q200; Manufacturer 1: Yageo Group; Power Dissipation: 125mW; Resistance: 100Ω; Temperature Coefficient: 100ppm/°C; Voltage Rating: 50V; Working Voltage: 75V; Supplier 1: DigiKey; Manufacturer Part Number 1: AC0402FR-7W100RL; Stock 1: 97922; Pricing 1: 1=0,1, 10=0,006, 25=0,0056, 50=0,0052, 100=0,005 (USD); RoHS: Compliant; Case/Package: 0402; China RoHS: Non-Compliant; Composition: Thick Film; Country of Origin: Mainland China, Taiwan; Export Control Classification Number (ECCN) Code: EAR99; Height: 320µm; Harmonized Tariff Schedule (HTS) Code: 8533.21.00.30; Introduction Date: 2017-06-20; Lifecycle Status: Production; Max Operating Temperature: 155°C; Min Operating Temperature: -55°C; Mount: Surface Mount; Number of Terminals: 2; Packaging: Tape & Reel; Power Rating: 125mW; REACH SVHC: Yes; Tolerance: 1%; Width: 500µm; ComponentLink1URL: https://datasheet.octopart.com:443/AC0402FR-7W100RL-Yageo-datasheet-182189377.pdf?src-supplier=IHS; ComponentLink1Description: https://datasheet.octopart.com:443/AC0402FR-7W100RL-Yageo-datasheet-182189377.pdf?src-supplier=IHS; ComponentLink2URL: https://datasheet.octopart.com:443/AC0402FR-7W100RL-Yageo-datasheet-83209224.pdf?src-supplier=Upverter; ComponentLink2Description: https://datasheet.octopart.com:443/AC0402FR-7W100RL-Yageo-datasheet-83209224.pdf?src-supplier=Upverter; ComponentLink3URL: https://datasheet.octopart.com:443/AC0402FR-7W100RL-Yageo-datasheet-178509465.pdf?src-supplier=Newark; ComponentLink3Description: https://datasheet.octopart.com:443/AC0402FR-7W100RL-Yageo-datasheet-178509465.pdf?src-supplier=Newark; ComponentLink4URL: https://datasheet.octopart.com:443/AC0402FR-7W100RL-Yageo-datasheet-164768995.pdf?src-supplier=ODG+(Origin+Data+Global); ComponentLink4Description: https://datasheet.octopart.com:443/AC0402FR-7W100RL-Yageo-datasheet-164768995.pdf?src-supplier=ODG+(Origin+Data+Global); ComponentLink5URL: https://datasheet.octopart.com:443/AC0402FR-7W100RL-Yageo-Group-datasheet-189830439.pdf?src-supplier=Future+Electronics; ComponentLink5Description: https://datasheet.octopart.com:443/AC0402FR-7W100RL-Yageo-Group-datasheet-189830439.pdf?src-supplier=Future+Electronics; ComponentLink6URL: https://datasheet.octopart.com:443/AC0402FR-7W100RL-Yageo-datasheet-166720450.pdf?src-supplier=Future+Electronics; ComponentLink6Description: https://datasheet.octopart.com:443/AC0402FR-7W100RL-Yageo-datasheet-166720450.pdf?src-supplier=Future+Electronics; ComponentLink7URL: https://datasheet.octopart.com:443/AC0402FR-7W100RL-Yageo-Group-datasheet-159083007.pdf?src-supplier=HQonline; ComponentLink7Description: https://datasheet.octopart.com:443/AC0402FR-7W100RL-Yageo-Group-datasheet-159083007.pdf?src-supplier=HQonline; ComponentLink8URL: https://datasheet.octopart.com/AC0402FR-7W100RL-Yageo-datasheet-12512238.pdf; ComponentLink8Description: https://datasheet.octopart.com/AC0402FR-7W100RL-Yageo-datasheet-12512238.pdf; ComponentLink9URL: http://sigma.octopart.com:80/conflict_mineral_statement/Yageo-company-3.pdf?src-supplier=Compliance+Statements; ComponentLink9Description: http://sigma.octopart.com:80/conflict_mineral_statement/Yageo-company-3.pdf?src-supplier=Compliance+Statements; ComponentLink10URL: http://sigma.octopart.com:80/rohs_statement/Yageo-company-2.pdf?src-supplier=Compliance+Statements; ComponentLink10Description: http://sigma.octopart.com:80/rohs_statement/Yageo-company-2.pdf?src-supplier=Compliance+Statements; Supplier Part Number 1: 13-AC0402FR-7W100RLCT-ND
R9 R10 R17 = RES_AC0402FR-7W10KL: Res Thick Film 0402 10K Ohm 1% 0.125W(1/8W) ±100ppm/C Pad SMD Automotive T/R; Manufacturer 1: Yageo Group; Power Dissipation: 125mW; Resistance: 10kΩ; Temperature Coefficient: 100ppm/°C; Voltage Rating: 50V; Working Voltage: 75V; Supplier 1: DigiKey; Manufacturer Part Number 1: AC0402FR-7W10KL; Stock 1: 252005; Pricing 1: 1=0,1, 10=0,012, 25=0,0096, 50=0,0072, 100=0,0051, 250=0,005 (USD); RoHS: Compliant; Case/Package: 0402; China RoHS: Non-Compliant; Composition: Thick Film; Height: 320µm; Lifecycle Status: Production; Max Operating Temperature: 155°C; Min Operating Temperature: -55°C; Mount: Surface Mount; Number of Terminals: 2; Packaging: Tape & Reel; Power Rating: 125mW; REACH SVHC: Yes; Tolerance: 1%; Width: 500µm; ComponentLink1URL: https://datasheet.octopart.com:443/AC0402FR-7W10KL-Yageo-datasheet-182189377.pdf?src-supplier=IHS; ComponentLink1Description: https://datasheet.octopart.com:443/AC0402FR-7W10KL-Yageo-datasheet-182189377.pdf?src-supplier=IHS; ComponentLink2URL: https://datasheet.octopart.com:443/AC0402FR-7W10KL-Yageo-datasheet-83209224.pdf?src-supplier=Upverter; ComponentLink2Description: https://datasheet.octopart.com:443/AC0402FR-7W10KL-Yageo-datasheet-83209224.pdf?src-supplier=Upverter; ComponentLink3URL: https://datasheet.octopart.com:443/AC0402FR-7W10KL-Yageo-datasheet-178509465.pdf?src-supplier=Farnell; ComponentLink3Description: https://datasheet.octopart.com:443/AC0402FR-7W10KL-Yageo-datasheet-178509465.pdf?src-supplier=Farnell; ComponentLink4URL: https://datasheet.octopart.com:443/AC0402FR-7W10KL-Yageo-datasheet-151884373.pdf?src-supplier=Future+Electronics; ComponentLink4Description: https://datasheet.octopart.com:443/AC0402FR-7W10KL-Yageo-datasheet-151884373.pdf?src-supplier=Future+Electronics; ComponentLink5URL: https://datasheet.octopart.com:443/AC0402FR-7W10KL-Yageo-Group-datasheet-189830439.pdf?src-supplier=Future+Electronics; ComponentLink5Description: https://datasheet.octopart.com:443/AC0402FR-7W10KL-Yageo-Group-datasheet-189830439.pdf?src-supplier=Future+Electronics; ComponentLink6URL: https://datasheet.octopart.com:443/AC0402FR-7W10KL-Yageo-datasheet-166720450.pdf?src-supplier=Future+Electronics; ComponentLink6Description: https://datasheet.octopart.com:443/AC0402FR-7W10KL-Yageo-datasheet-166720450.pdf?src-supplier=Future+Electronics; ComponentLink7URL: https://datasheet.octopart.com:443/AC0402FR-7W10KL-Yageo-Group-datasheet-164768995.pdf?src-supplier=ODG+(Origin+Data+Global); ComponentLink7Description: https://datasheet.octopart.com:443/AC0402FR-7W10KL-Yageo-Group-datasheet-164768995.pdf?src-supplier=ODG+(Origin+Data+Global); ComponentLink8URL: https://datasheet.octopart.com:443/AC0402FR-7W10KL-Yageo-Group-datasheet-159083007.pdf?src-supplier=HQonline; ComponentLink8Description: https://datasheet.octopart.com:443/AC0402FR-7W10KL-Yageo-Group-datasheet-159083007.pdf?src-supplier=HQonline; ComponentLink9URL: https://datasheet.octopart.com/AC0402FR-7W10KL-Yageo-datasheet-12512238.pdf; ComponentLink9Description: https://datasheet.octopart.com/AC0402FR-7W10KL-Yageo-datasheet-12512238.pdf; ComponentLink10URL: http://sigma.octopart.com:80/conflict_mineral_statement/Yageo-company-3.pdf?src-supplier=Compliance+Statements; ComponentLink10Description: http://sigma.octopart.com:80/conflict_mineral_statement/Yageo-company-3.pdf?src-supplier=Compliance+Statements; ComponentLink11URL: http://sigma.octopart.com:80/rohs_statement/Yageo-company-2.pdf?src-supplier=Compliance+Statements; ComponentLink11Description: http://sigma.octopart.com:80/rohs_statement/Yageo-company-2.pdf?src-supplier=Compliance+Statements; Supplier Part Number 1: 13-AC0402FR-7W10KLCT-ND
R15 R16 = RES_AC0402FR-7W1KL: Res Thick Film 0402 1K Ohm 1% 0.125W(1/8W) ±100ppm/C Pad SMD Automotive T/R; Manufacturer 1: Yageo Group; Power Dissipation: 125mW; Resistance: 1kΩ; Temperature Coefficient: 100ppm/°C; Voltage Rating: 50V; Working Voltage: 75V; Supplier 1: DigiKey; Manufacturer Part Number 1: AC0402FR-7W1KL; Stock 1: 24249; Pricing 1: 1=0,1, 10=0,009, 25=0,0072, 50=0,0052, 100=0,005 (USD); RoHS: Compliant; Case/Package: 0402; China RoHS: Non-Compliant; Composition: Thick Film; Country of Origin: Mainland China, Taiwan; Export Control Classification Number (ECCN) Code: EAR99; Height: 320µm; Harmonized Tariff Schedule (HTS) Code: 8533.21.00.30; Introduction Date: 2017-06-20; Lifecycle Status: Production; Max Operating Temperature: 155°C; Min Operating Temperature: -55°C; Mount: Surface Mount; Number of Terminals: 2; Packaging: Tape & Reel; Power Rating: 125mW; REACH SVHC: Yes; Tolerance: 1%; Width: 500µm; ComponentLink1URL: https://datasheet.octopart.com:443/AC0402FR-7W1KL-Yageo-datasheet-182189377.pdf?src-supplier=IHS; ComponentLink1Description: https://datasheet.octopart.com:443/AC0402FR-7W1KL-Yageo-datasheet-182189377.pdf?src-supplier=IHS; ComponentLink2URL: https://datasheet.octopart.com:443/AC0402FR-7W1KL-Yageo-datasheet-83209224.pdf?src-supplier=Upverter; ComponentLink2Description: https://datasheet.octopart.com:443/AC0402FR-7W1KL-Yageo-datasheet-83209224.pdf?src-supplier=Upverter; ComponentLink3URL: https://datasheet.octopart.com:443/AC0402FR-7W1KL-Yageo-datasheet-178509465.pdf?src-supplier=Farnell; ComponentLink3Description: https://datasheet.octopart.com:443/AC0402FR-7W1KL-Yageo-datasheet-178509465.pdf?src-supplier=Farnell; ComponentLink4URL: https://datasheet.octopart.com:443/AC0402FR-7W1KL-Yageo-datasheet-166720450.pdf?src-supplier=Future+Electronics; ComponentLink4Description: https://datasheet.octopart.com:443/AC0402FR-7W1KL-Yageo-datasheet-166720450.pdf?src-supplier=Future+Electronics; ComponentLink5URL: https://datasheet.octopart.com:443/AC0402FR-7W1KL-Yageo-datasheet-151884373.pdf?src-supplier=Future+Electronics; ComponentLink5Description: https://datasheet.octopart.com:443/AC0402FR-7W1KL-Yageo-datasheet-151884373.pdf?src-supplier=Future+Electronics; ComponentLink6URL: https://datasheet.octopart.com:443/AC0402FR-7W1KL-Yageo-datasheet-137699919.pdf?src-supplier=Future+Electronics; ComponentLink6Description: https://datasheet.octopart.com:443/AC0402FR-7W1KL-Yageo-datasheet-137699919.pdf?src-supplier=Future+Electronics; ComponentLink7URL: https://datasheet.octopart.com:443/AC0402FR-7W1KL-Yageo-Group-datasheet-164768995.pdf?src-supplier=ODG+(Origin+Data+Global); ComponentLink7Description: https://datasheet.octopart.com:443/AC0402FR-7W1KL-Yageo-Group-datasheet-164768995.pdf?src-supplier=ODG+(Origin+Data+Global); ComponentLink8URL: https://datasheet.octopart.com:443/AC0402FR-7W1KL-Yageo-Group-datasheet-159083007.pdf?src-supplier=HQonline; ComponentLink8Description: https://datasheet.octopart.com:443/AC0402FR-7W1KL-Yageo-Group-datasheet-159083007.pdf?src-supplier=HQonline; ComponentLink9URL: https://datasheet.octopart.com/AC0402FR-7W1KL-Yageo-datasheet-12512238.pdf; ComponentLink9Description: https://datasheet.octopart.com/AC0402FR-7W1KL-Yageo-datasheet-12512238.pdf; ComponentLink10URL: http://sigma.octopart.com:80/conflict_mineral_statement/Yageo-company-3.pdf?src-supplier=Compliance+Statements; ComponentLink10Description: http://sigma.octopart.com:80/conflict_mineral_statement/Yageo-company-3.pdf?src-supplier=Compliance+Statements; ComponentLink11URL: http://sigma.octopart.com:80/rohs_statement/Yageo-company-2.pdf?src-supplier=Compliance+Statements; ComponentLink11Description: http://sigma.octopart.com:80/rohs_statement/Yageo-company-2.pdf?src-supplier=Compliance+Statements; Supplier Part Number 1: 13-AC0402FR-7W1KLCT-ND